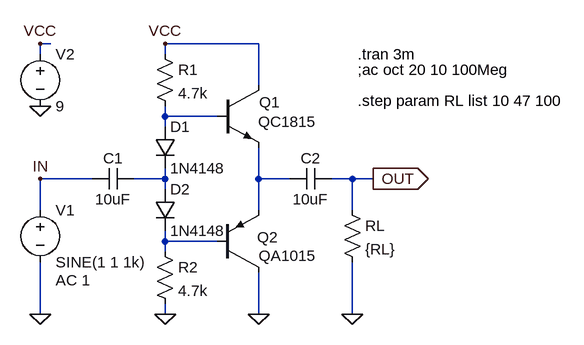
[diagram p0: schematic Push-Pull_Diode_Offset_Ex.asc]
Push-Pull_Diode_Offset_Ex.asc, the LTspice schematic file:
Version 4
SHEET 1 880 680
WIRE -32 -32 -48 -32
WIRE 288 -32 144 -32
WIRE -48 -16 -48 -32
WIRE 144 -16 144 -32
WIRE 288 32 288 -32
WIRE 144 80 144 64
WIRE 224 80 144 80
WIRE 144 96 144 80
WIRE 32 176 -48 176
WIRE 144 176 144 160
WIRE 144 176 96 176
WIRE 288 176 288 128
WIRE 336 176 288 176
WIRE 432 176 400 176
WIRE 464 176 432 176
WIRE 144 192 144 176
WIRE -48 224 -48 176
WIRE 288 224 288 176
WIRE 432 224 432 176
WIRE 144 272 144 256
WIRE 224 272 144 272
WIRE 144 288 144 272
WIRE -48 384 -48 304
WIRE 144 384 144 368
WIRE 288 384 288 320
WIRE 432 384 432 304
FLAG 144 384 0
FLAG 288 384 0
FLAG 432 384 0
FLAG -48 384 0
FLAG -48 64 0
FLAG -48 -32 VCC
FLAG 144 -32 VCC
FLAG 464 176 OUT
IOPIN 464 176 Out
FLAG -48 176 IN
SYMBOL npn 224 32 R0
WINDOW 0 65 26 Left 2
WINDOW 3 63 56 Left 2
SYMATTR InstName Q1
SYMATTR Value QC1815
SYMBOL pnp 224 320 M180
WINDOW 0 62 54 Left 2
WINDOW 3 64 26 Left 2
SYMATTR InstName Q2
SYMATTR Value QA1015
SYMBOL cap 400 160 R90
WINDOW 0 0 32 VBottom 2
WINDOW 3 32 32 VTop 2
SYMATTR InstName C2
SYMATTR Value 10uF
SYMBOL res 416 208 R0
SYMATTR InstName RL
SYMATTR Value {RL}
SYMBOL res 128 -32 R0
SYMATTR InstName R1
SYMATTR Value 4.7k
SYMBOL res 128 272 R0
SYMATTR InstName R2
SYMATTR Value 4.7k
SYMBOL cap 96 160 R90
WINDOW 0 0 32 VBottom 2
WINDOW 3 32 32 VTop 2
SYMATTR InstName C1
SYMATTR Value 10uF
SYMBOL voltage -48 208 R0
WINDOW 123 24 124 Left 2
WINDOW 39 0 0 Left 2
SYMATTR Value2 AC 1
SYMATTR InstName V1
SYMATTR Value SINE(1 1 1k)
SYMBOL voltage -48 -32 R0
WINDOW 123 0 0 Left 2
WINDOW 39 0 0 Left 2
SYMATTR InstName V2
SYMATTR Value 9
SYMBOL diode 128 96 R0
SYMATTR InstName D1
SYMATTR Value 1N4148
SYMBOL diode 128 192 R0
SYMATTR InstName D2
SYMATTR Value 1N4148
TEXT 440 56 Left 2 !.step param RL list 10 47 100
TEXT 440 -16 Left 2 !.tran 3m
TEXT 440 8 Left 2 !;ac oct 20 10 100Meg

The netlist it stands for:
* Push-Pull_Diode_Offset_Ex.asc
Q1 VCC N001 N003 0 QC1815
Q2 0 N004 N003 0 QA1015
C2 OUT N003 10uF
RL OUT 0 {RL}
R1 VCC N001 4.7k
R2 N004 0 4.7k
C1 N002 IN 10uF
V1 IN 0 SINE(1 1 1k) AC 1
V2 VCC 0 9
D1 N001 N002 1N4148
D2 N002 N004 1N4148
.model D D
.lib standard.dio
.model NPN NPN
.model PNP PNP
.lib standard.bjt
.step param RL list 10 47 100
.tran 3m
;ac oct 20 10 100Meg
.backanno
.end